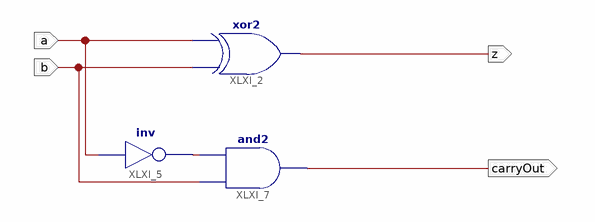
[diagram p0: schematic sheet 1]
// Xilinx ISE schematic halfSubtractor.sch (spartan6) as structural Verilog: 3 symbols, 4 ports
module halfSubtractor (
  input  b,
  input  a,
  output z,
  output carryOut
);

  wire XLXN_14;

  xor XLXI_2 (z, b, a);
  not XLXI_5 (XLXN_14, a);
  and XLXI_7 (carryOut, b, XLXN_14);
endmodule
